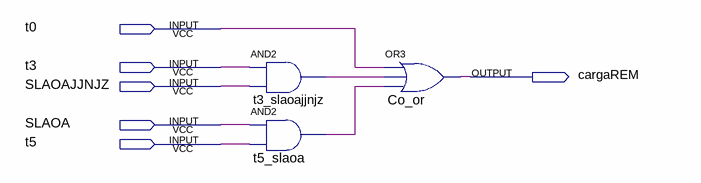
[diagram p0: schematic sheet]
// Quartus schematic carga_rem.bdf as structural Verilog: 3 symbols, 6 pins
module carga_rem (
  input  t0,
  input  t3,
  input  SLAOAJJNJZ,
  input  SLAOA,
  input  t5,
  output cargaREM
);

  wire t3_slaoajjnjz_out, t5_slaoa_out;

  and t3_slaoajjnjz (t3_slaoajjnjz_out, t3, SLAOAJJNJZ);
  and t5_slaoa (t5_slaoa_out, SLAOA, t5);
  or Co_or (cargaREM, t0, t3_slaoajjnjz_out, t5_slaoa_out);
endmodule
